# EAGLE design MP3_Testboard (EAGLE 9.2.0)
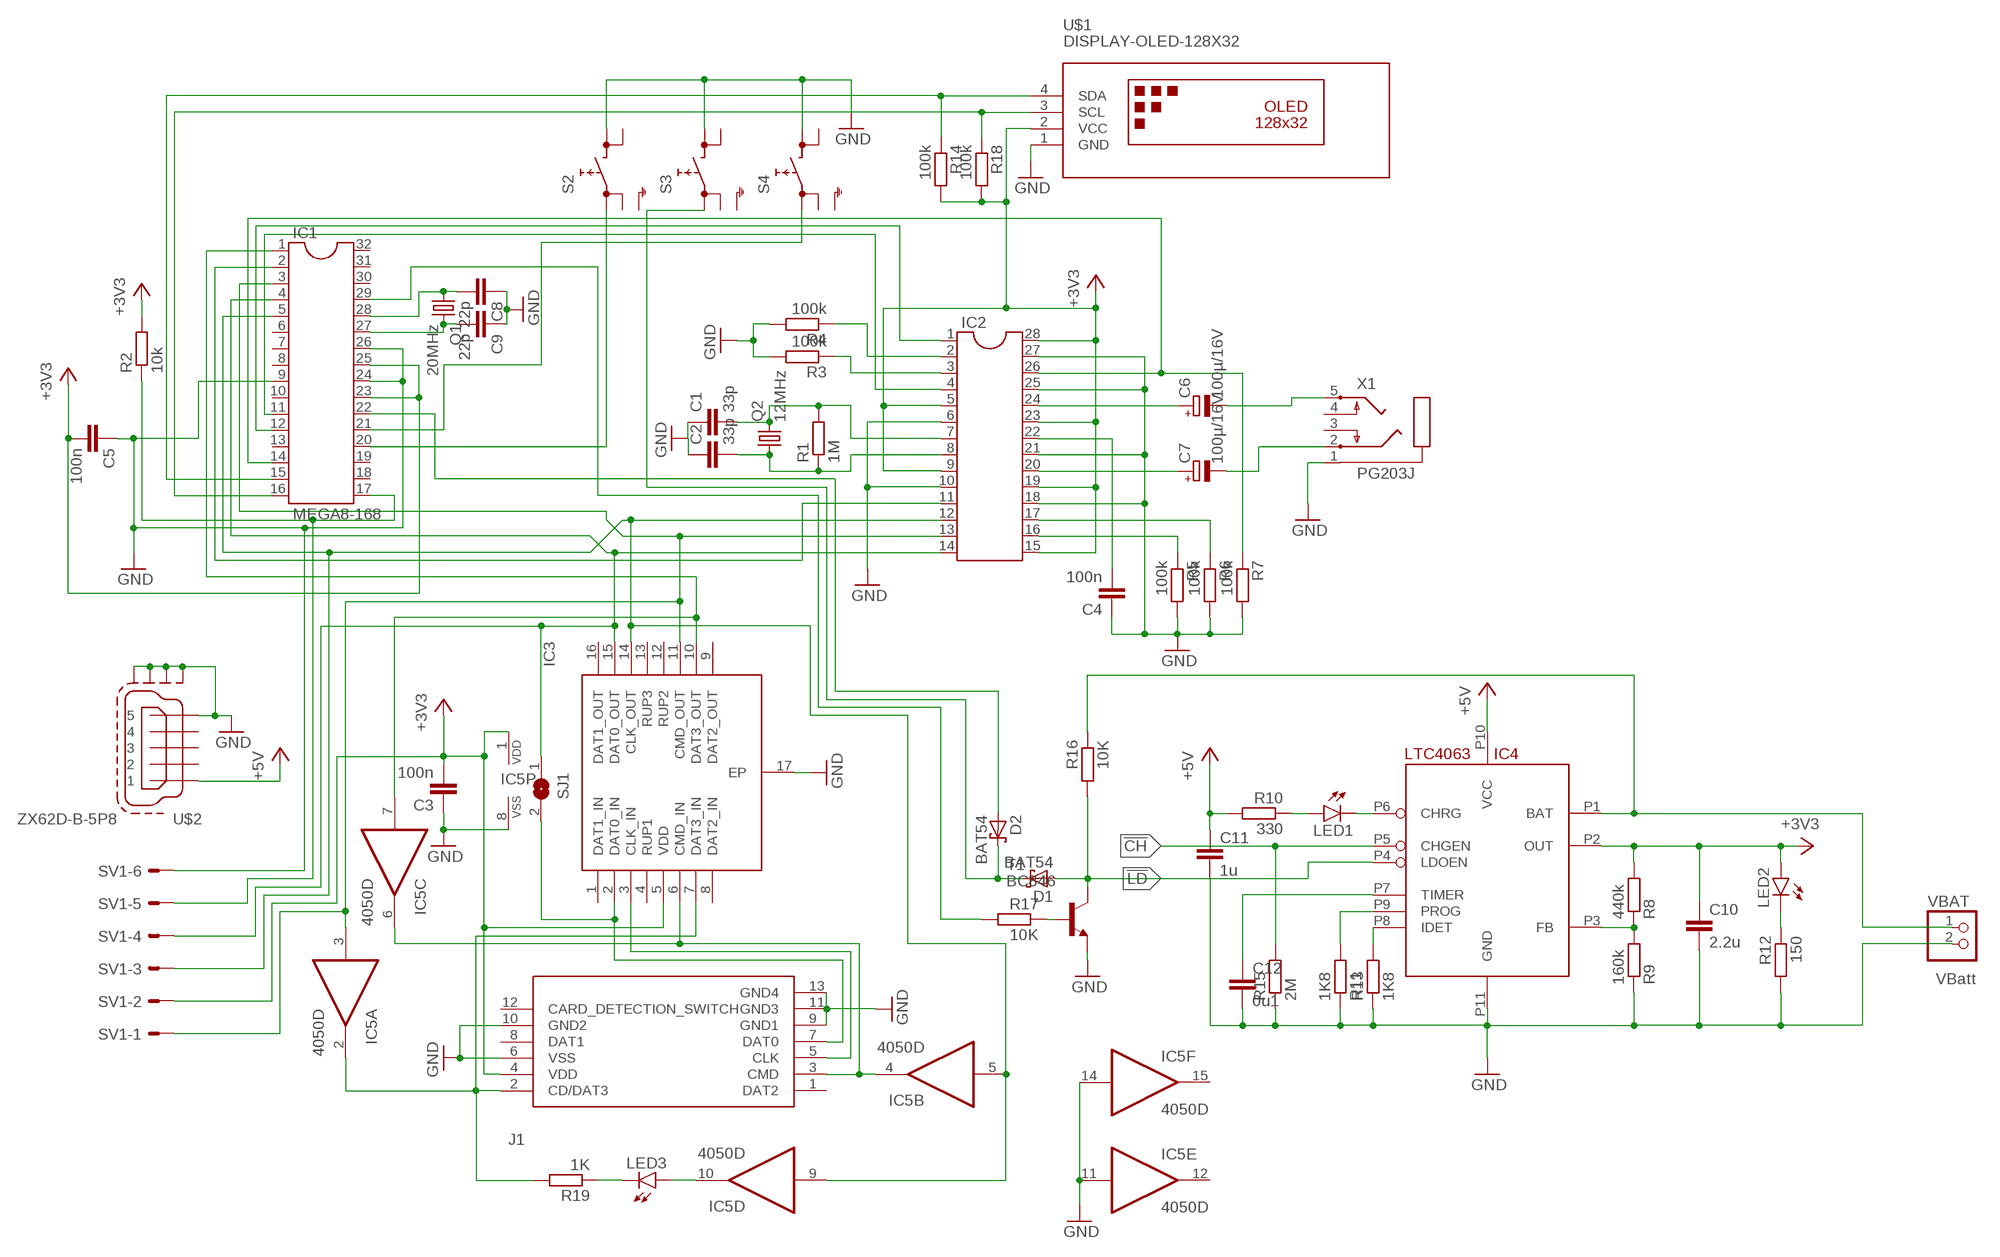
[diagram p0: schematic, sheet 1]

## Parts
C1  33p  C-EUC1206K  [C1206K]
C2  33p  C-EUC1206K  [C1206K]
C3  100n  C-EUC1206K  [C1206K]
C4  100n  C-EUC1206K  [C1206K]
C5  100n  C-EUC1206K  [C1206K]
C6  100µ/16V  CPOL-EUUD-6,3X7,7  [UD-6,3X7,7_NICHICON]
C7  100µ/16V  CPOL-EUUD-6,3X7,7  [UD-6,3X7,7_NICHICON]
C8  22p  C-EUC1206K  [C1206K]
C9  22p  C-EUC1206K  [C1206K]
C10  2.2u  C-EUC0805K  [C0805K]
C11  1u  C-EUC0805K  [C0805K]
C12  0u1  C-EUC0805K  [C0805K]
D1  BAT54  [SOT23]
D2  BAT54  [SOT23]
IC1  MEGA8-168  DIL32  [DIL32]
IC2  DIL28-3  [DIL28-3]
IC3  ECLAMP2410P.TCT  [SON50P160X400X65-17N]
IC4  LTC4063  [LTC4063]
IC5  4050D  [SO16]
J1  DM3CS-SF  [DM3CS-SF]
LED1  LG_T679-E1F1-1  [PLCC2]
LED2  LG_T679-E1F1-1  [PLCC2]
LED3  LG_T679-E1F1-1  [PLCC2]
Q1  20MHz  CRYSTALHC49UP  [HC49UP]
Q2  12MHz  CRYSTALHC49UP  [HC49UP]
R1  1M  R-EU_R0805  [R0805]
R2  10k  R-EU_0207/10  [0207/10]
R3  100k  R-EU_R1206  [R1206]
R4  100k  R-EU_R1206  [R1206]
R5  100k  R-EU_R0805  [R0805]
R6  100k  R-EU_R0805  [R0805]
R7  100k  R-EU_R1206  [R1206]
R8  440k  R-EU_R0805  [R0805]
R9  160k  R-EU_R0805  [R0805]
R10  330  R-EU_R0805  [R0805]
R11  1K8  R-EU_R0805  [R0805]
R12  150  R-EU_R0805  [R0805]
R13  1K8  R-EU_R1206  [R1206]
R14  100k  R-EU_R1206  [R1206]
R15  2M  R-EU_R0805  [R0805]
R16  10K  R-EU_0207/10  [0207/10]
R17  10K  R-EU_R0805  [R0805]
R18  100k  R-EU_R1206  [R1206]
R19  1K  R-EU_R1206  [R1206]
S2  SKHMPSE010  [SKHMPXE010]
S3  SKHMPSE010  [SKHMPXE010]
S4  SKHMPSE010  [SKHMPXE010]
SJ1  SJ  [SJ]
SV1  ML6E  [ML6]
T1  BC846  [SOT23]
U$1  DISPLAY-OLED-128X32  [DISPLAY-OLED-128X32]
U$2  ZX62D-B-5P8  [ZX62D-B-5P8]
VBAT  PINHD-1X2  [1X02]
X1  PG203J  [PG203J]

## Nets
!CH: IC4.P5(CHGEN) R15.2
!LD: D1.1(A) IC4.P4(LDOEN) R16.2 T1.3(C)
+3V3: C3.2 C5.2 C10.1 IC1.23 IC1.25 IC2.5 IC2.9 IC2.15 IC2.19 IC2.23 IC2.28 IC3.5(VDD) IC4.P2(OUT) IC5.1(P:VDD) J1.4(VDD) LED2.A R2.2 R8.2 R14.2 R18.2 SV1.2 U$1.2(VCC)
+5V: C11.1 IC4.P10(VCC) R10.2 U$2.P$1
GND: C1.1 C2.1 C3.1 C4.1 C5.1 C8.1 C9.1 C10.2 C11.2 C12.2 IC1.9 IC1.24 IC1.26 IC2.6 IC2.10 IC2.18 IC2.21 IC2.25 IC2.27 IC3.17(EP) IC4.P11(GND) IC5.8(P:VSS) IC5.11(E:I) IC5.14(F:I) J1.6(VSS) J1.9(GND1) J1.10(GND2) J1.11(GND3) J1.13(GND4) R3.2 R4.2 R5.2 R6.2 R7.2 R9.1 R11.1 R12.2 R13.1 R15.1 S2.3(2.1) S3.3(2.1) S4.3(2.1) SV1.6 T1.2(E) U$1.1(GND) U$2.P$5 U$2.SH1 U$2.SH2 U$2.SH3 U$2.SH4 VBAT.2 X1.1
N$2: IC1.4 IC2.14 IC3.15(DAT0_OUT) SJ1.1 SV1.4
N$3: IC1.5 IC2.12 IC3.14(CLK_OUT) IC5.5(B:I) IC5.9(D:I) SV1.3
N$5: IC1.2 IC2.11
N$6: C2.2 IC2.8 Q2.1 R1.1
N$7: IC1.11 IC2.4
N$8: C4.2 IC2.22
N$9: IC2.3 R3.1
N$10: C1.2 IC2.7 Q2.2 R1.2
N$11: IC2.2 R4.1
N$12: IC1.20 S2.1(1.1)
N$13: IC2.17 R6.1
N$14: IC2.16 R5.1
N$15: IC1.12 IC2.1
N$16: D2.1(A) IC1.22
N$17: IC1.14 IC2.26 R7.1
N$18: IC5.10(D:O) LED3.A
N$19: C7.+ IC2.20
N$20: C6.+ IC2.24
N$21: IC1.21 S4.1(1.1)
N$22: C6.- X1.5
N$23: C7.- X1.2
N$24: C8.2 IC1.28 Q1.1
N$25: C9.2 IC1.27 Q1.2
N$26: LED3.C R19.1
N$27: IC1.17 R2.1 SV1.5
N$28: IC4.P3(FB) R8.1 R9.2
N$29: IC3.7(DAT3_IN) IC5.2(A:O) J1.2(CD/DAT3) R19.2
N$30: IC3.2(DAT0_IN) J1.7(DAT0) SJ1.2
N$31: IC3.3(CLK_IN) J1.5(CLK)
N$32: IC3.6(CMD_IN) IC5.4(B:O) IC5.6(C:O) J1.3(CMD)
N$33: IC4.P1(BAT) R16.1 VBAT.1
N$34: LED1.A R10.1
N$35: IC4.P9(PROG) R11.2
N$36: IC4.P6(CHRG) LED1.C
N$37: LED2.C R12.1
N$38: IC4.P8(IDET) R13.2
N$39: C12.1 IC4.P7(TIMER)
N$40: IC1.15 R14.1 U$1.4(SDA)
N$41: IC1.16 R18.1 U$1.3(SCL)
N$42: IC1.3 IC2.13 IC3.11(CMD_OUT) IC5.3(A:I) SV1.1
N$43: IC1.1 IC3.10(DAT3_OUT) IC5.7(C:I)
N$47: R17.1 T1.1(B)
N$49: IC1.29 R17.2
N$51: D1.3(C) D2.3(C) S3.1(1.1)
Unconnected: IC1.6 IC1.7 IC1.8 IC1.10 IC1.13 IC1.18 IC1.19 IC1.30 IC1.31 IC1.32 IC3.1(DAT1_IN) IC3.4(RUP1) IC3.8(DAT2_IN) IC3.9(DAT2_OUT) IC3.12(RUP2) IC3.13(RUP3) IC3.16(DAT1_OUT) IC5.12(E:O) IC5.15(F:O) J1.1(DAT2) J1.8(DAT1) J1.12(CARD_DETECTION_SWITCH) S2.2(1.2) S2.4(2.2) S2.5(SH) S3.2(1.2) S3.4(2.2) S3.5(SH) S4.2(1.2) S4.4(2.2) S4.5(SH) U$2.P$2 U$2.P$3 U$2.P$4 X1.3 X1.4

## Notes on the sheet
- VBatt

## Library data of the parts
C1-C5 C10-C12 = rcl:C-EU: CAPACITOR, European symbol
C6 C7 = rcl:CPOL-EU: POLARIZED CAPACITOR, European symbol
C8 C9 = rcl:C-EU: CAPACITOR, European symbol; SPICEPREFIX: C
D1 D2 = diode:BAT54: Schottky Diodes Source: Fairchild .. BAT54.pdf
IC1 = ic-package:DIL32: Dual In Line
IC2 = ic-package:DIL28: Dual In Line
IC3 = SamacSys_Parts:ECLAMP2410P.TCT: EClamp ESD-EMI Protect T-Flash/MicroSD Semtech ECLAMP2410P.TCT, Hex Bi-Directional EMI Filter & ESD Protector, 16-Pin SLP EP Source: Datasheet <http://www.semtech.com/images/datasheet/eclamp2410p.pdf>; ARROW_PART_NUMBER: ECLAMP2410P.TCT; ARROW_PRICE/STOCK: https://www.arrow.com/en/products/eclamp2410p.tct/semtech; DESCRIPTION: EClamp ESD-EMI Protect T-Flash/MicroSD Semtech ECLAMP2410P.TCT, Hex Bi-Directional EMI Filter & ESD Protector, 16-Pin SLP EP; HEIGHT: 0.65mm; MANUFACTURER_NAME: SEMTECH; MANUFACTURER_PART_NUMBER: ECLAMP2410P.TCT; RS_PART_NUMBER: 6910638; RS_PRICE/STOCK: http://uk.rs-online.com/web/p/products/6910638
IC4 = LinearTechnology:LTC4063: LTC4063 - Standalone Linear Li-Ion Charger with Micropower Low Dropout Linear Regulator The LTC®4063 is a standalone linear charger for single cell lithium-ion batteries with an adjustable low dropout linear regulator (LDO). The adjustable LDO regulates an output voltage between 1.2V to 4.2V at up to 100mA load cur- rent. When the input supply (wall adapter or USB supply) is removed, the LDO regulates the output voltage without interruption. The battery charger and LDO regulator can be enabled individually. No external sense resistor or external blocking diode is required for charging due to the internal MOSFET archi- tecture. For more details have a look at the data sheet <http://cds.linear.com/docs/en/datasheet/4063fc.pdf>. Copyright (c) 2013, Michael Hohl <http://www.michaelhohl.net>
IC5 = 40xx:4050: Hex non-inverting BUFFER
J1 = SamacSys_Parts:DM3CS-SF: MicroSD card connector, push-pull type MicroSD card connector, push-pull type Source: Datasheet <http://docs-europe.electrocomponents.com/webdocs/118f/0900766b8118f8bb.pdf>; ARROW_PART_NUMBER: DM3CS-SF; ARROW_PRICE/STOCK: https://www.arrow.com/en/products/dm3cs-sf/hirose-electric; DESCRIPTION: MicroSD card connector, push-pull type MicroSD card connector, push-pull type; HEIGHT: mm; MANUFACTURER_NAME: Hirose; MANUFACTURER_PART_NUMBER: DM3CS-SF; RS_PART_NUMBER: 1664833; RS_PRICE/STOCK: http://uk.rs-online.com/web/p/products/1664833
LED1-LED3 = led:*_T679-?-1: LC TOPLED® Low Current LED Source: http://catalog.osram-os.com .. LG_LS_LY_T679_OBS.pdf; COLOR: green
Q1 = crystal:CRYSTAL: CRYSTAL; OC_FARNELL: unknown; OC_NEWARK: unknown
Q2 = crystal:CRYSTAL: CRYSTAL
R1-R10 R12-R19 = rcl:R-EU_: RESISTOR, European symbol; SPICEPREFIX: R
R11 = rcl:R-EU_: RESISTOR, European symbol
S2-S4 = switch:SKHMP*E010: 6.2 X 6.5mm TACT Switch (SMD) Source: http://www3.alps.co.jp/WebObjects/catalog.woa/PDF/E/Switch/Tact/SKHM/SKHM.PDF
SJ1 = jumper:SJ: SMD solder JUMPER
SV1 = con-ml:ML6E: HARTING; OC_FARNELL: unknown; OC_NEWARK: unknown
T1 = transistor-neu-to92:BC846: NPN TRANSISTOR
U$1 = diy-modules:DISPLAY-OLED-128X32: 128x32 Dot Matrix OLED Module with I2C interface based on SSD1306 chip More details available here: http://www.tinyosshop.com/index.php?route=product/product&product_id=953 Schematic available here: http://www.tinyosshop.com/datasheet/OLED%2012832.pdf SSD1306 datasheet: https://cdn-shop.adafruit.com/datasheets/SSD1306.pdf Click here to find device on ebay.com <http://www.ebay.com/sch/oled+display+128x32+i2c>
U$2 = j_usb_hirose_zx62d-b-5p8:ZX62D-B-5P8: Hirose ZX62D-B-5P8 Micro-B USB connector, standard mount location, with through-hold shell tabs and SMD pins.
VBAT = pinhead:PINHD-1X2: PIN HEADER
X1 = con-hirschmann:PG203J: MIC/HEADPHONE JACK KS-S stereo microphone/headphone jack PG203JN (Schukat); OC_FARNELL: unknown; OC_NEWARK: unknown

## Board
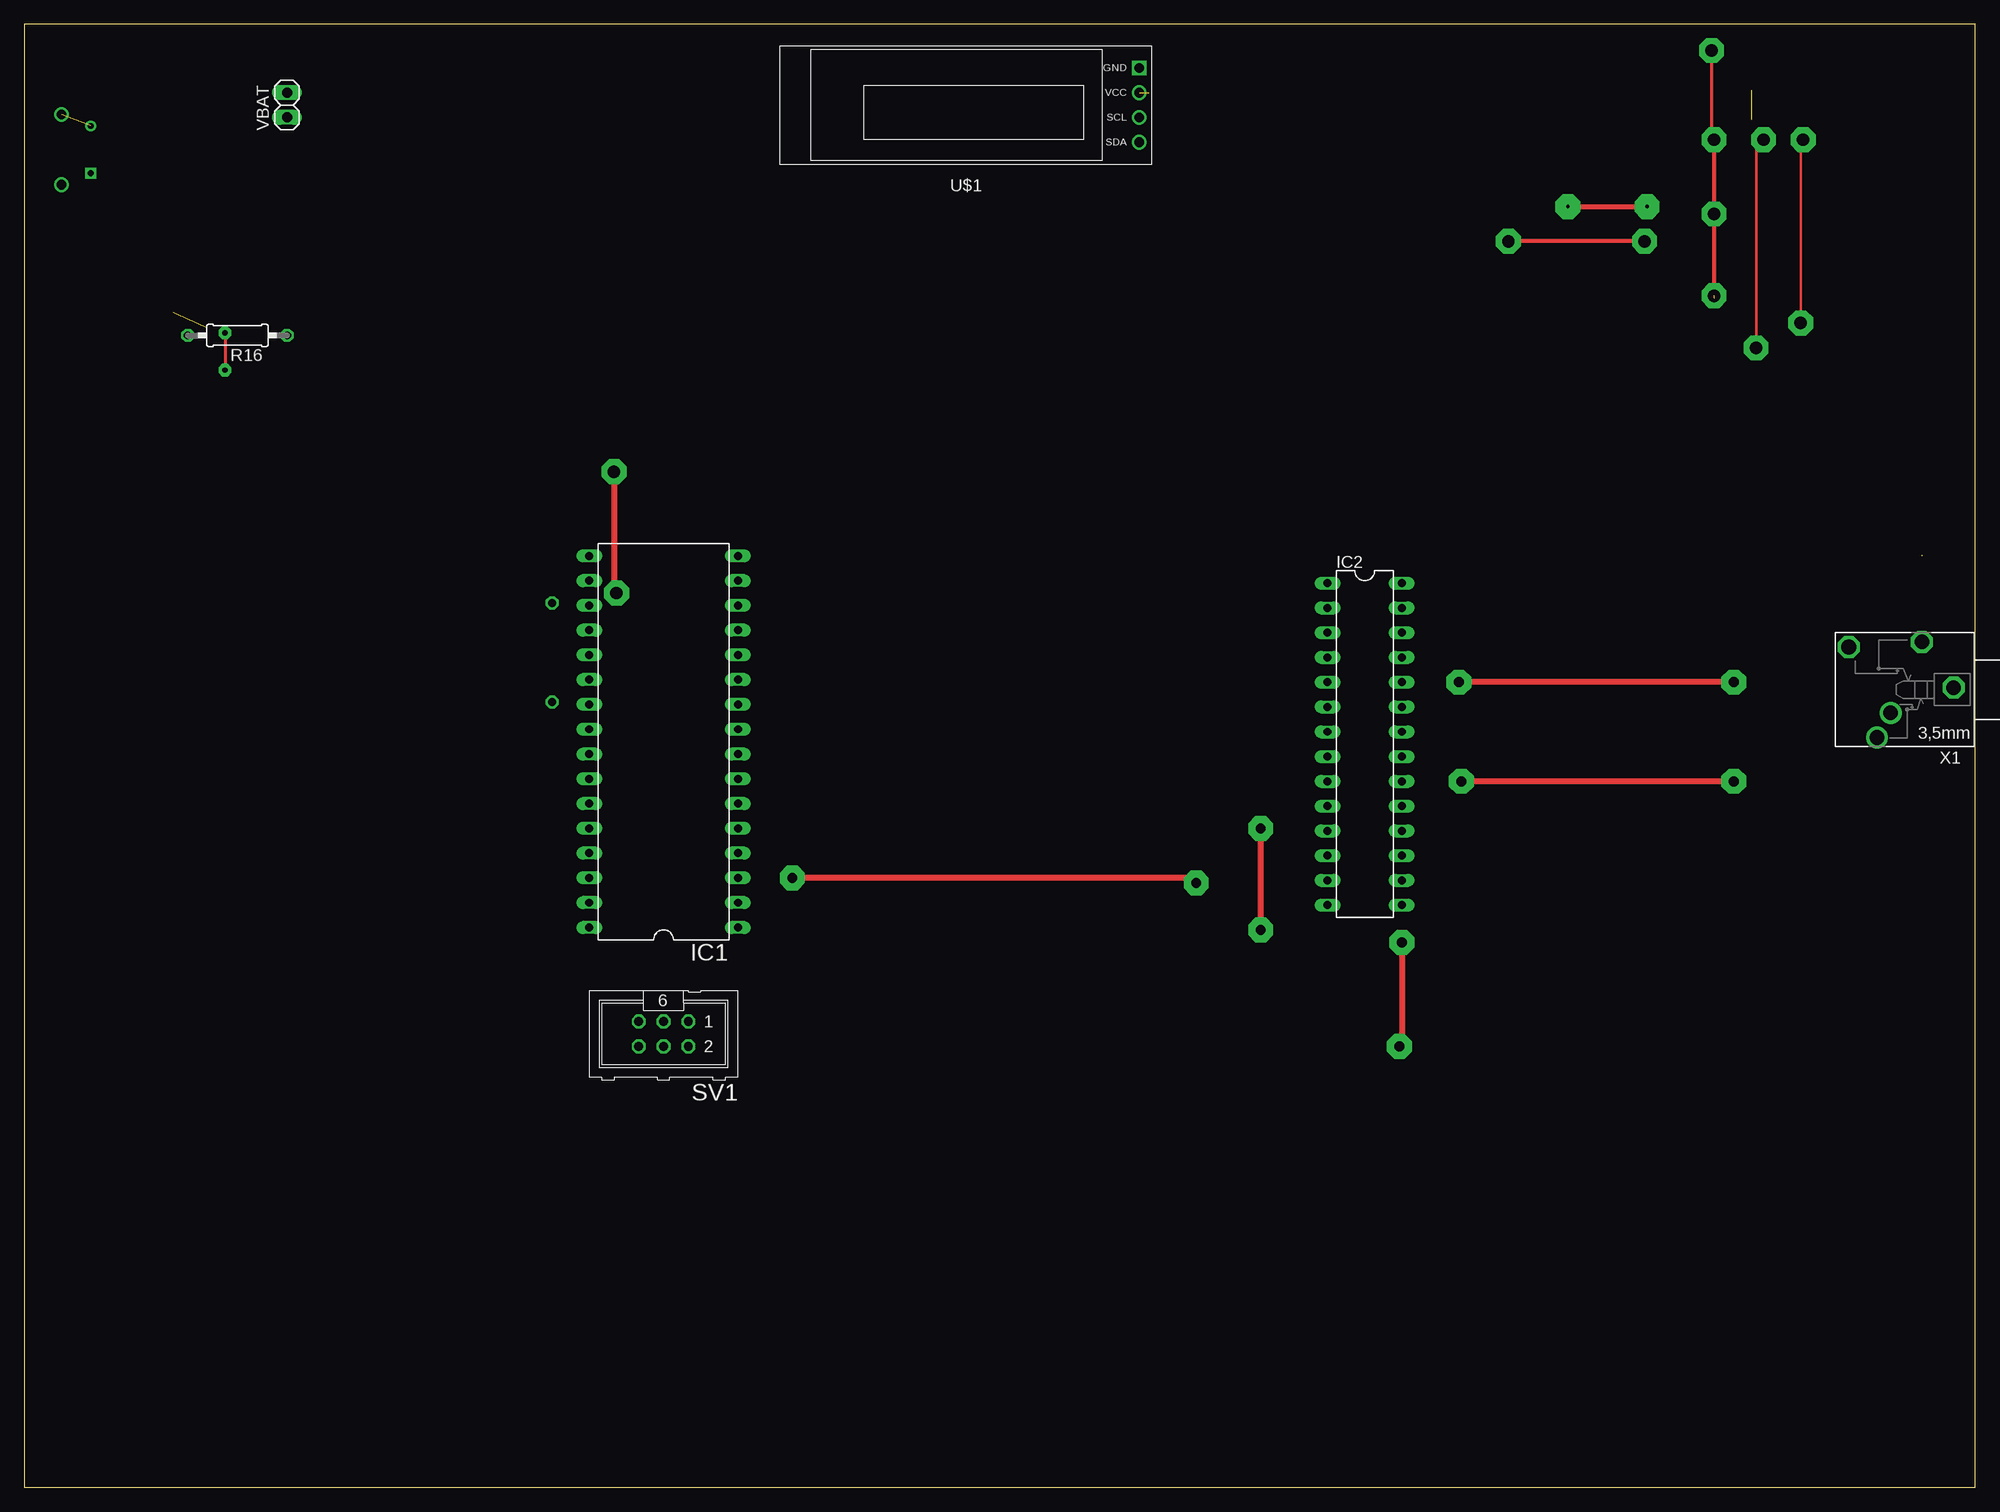
[diagram p1: board, top side]
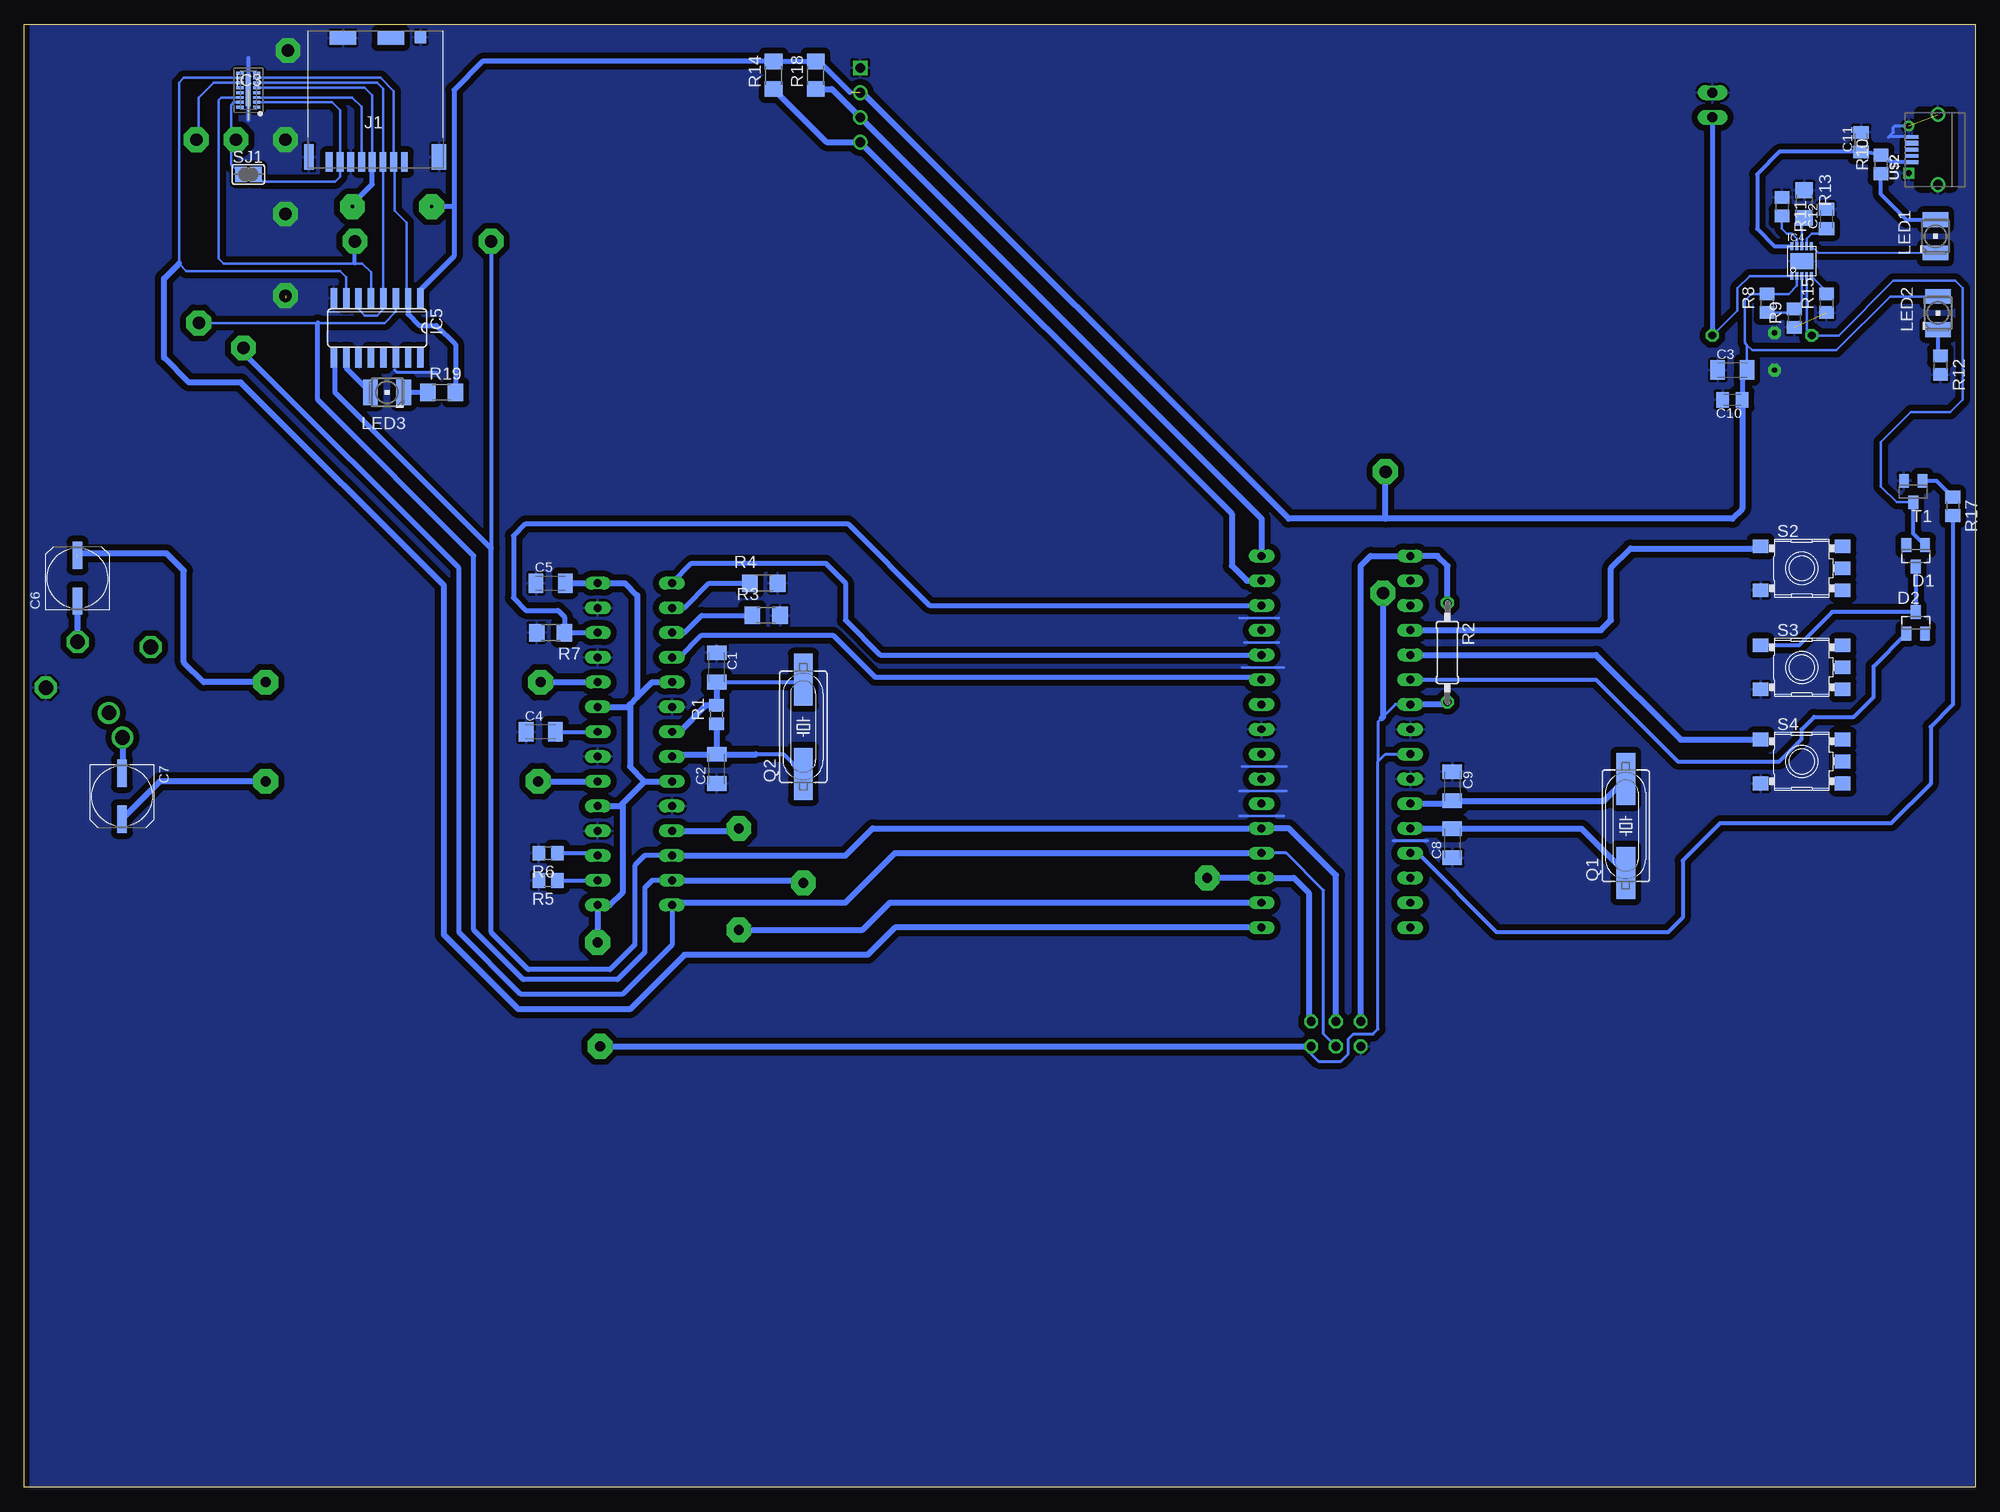
[diagram p2: board, bottom side, seen from below]

Size 200 x 150 mm. Coordinates in mm from the lower left corner, seen from the top.
Outline: 0,0 200,0 200,150 0,150 0,0
Copper layers (1*16): Top 0.035mm / dielectric 1.5mm / Bottom 0.035mm
Design rules "default *": minimum track width 6mil, minimum drill 0.35mm, track to track 6mil, track to pad 6mil, pad to pad 6mil, via to via 6mil, smd to smd 6mil, copper to edge 0mil, drill to drill 6mil, minimum pad ring 10mil, minimum via ring 8mil, stop-mask expansion 4mil, vias tented up to drill 0mil, thermal gap 10mil

### Footprints (pad centres in the part's own frame; a part is rotated, then mirrored left to right if it is on the bottom)
C1206K = smd 1.5 x 2: 1 -1.5,0; 2 1.5,0
UD-6,3X7,7_NICHICON = smd 2.8 x 1: + 2.35,0; - -2.35,0
C0805K = smd 1.3 x 1.6: 1 -1,0; 2 1,0
SOT23 = smd 1 x 1.4: 1 -0.95,-1.1; 2 0.95,-1.1; 3 0,1.1
DIL32 = drill 0.813 long: 1 -19.05,-7.62; 2 -16.51,-7.62; 3 -13.97,-7.62; 4 -11.43,-7.62; 5 -8.89,-7.62; 6 -6.35,-7.62; 7 -3.81,-7.62; 8 -1.27,-7.62; 9 1.27,-7.62; 10 3.81,-7.62; 11 6.35,-7.62; 12 8.89,-7.62; 13 11.43,-7.62; 14 13.97,-7.62; 15 16.51,-7.62; 16 19.05,-7.62; 17 19.05,7.62; 18 16.51,7.62; 19 13.97,7.62; 20 11.43,7.62; 21 8.89,7.62; 22 6.35,7.62; 23 3.81,7.62; 24 1.27,7.62; 25 -1.27,7.62; 26 -3.81,7.62; 27 -6.35,7.62; 28 -8.89,7.62; 29 -11.43,7.62; 30 -13.97,7.62; 31 -16.51,7.62; 32 -19.05,7.62
DIL28-3 = drill 0.813 long: 1 -16.51,-3.81; 2 -13.97,-3.81; 3 -11.43,-3.81; 4 -8.89,-3.81; 5 -6.35,-3.81; 6 -3.81,-3.81; 7 -1.27,-3.81; 8 1.27,-3.81; 9 3.81,-3.81; 10 6.35,-3.81; 11 8.89,-3.81; 12 11.43,-3.81; 13 13.97,-3.81; 14 16.51,-3.81; 15 16.51,3.81; 16 13.97,3.81; 17 11.43,3.81; 18 8.89,3.81; 19 6.35,3.81; 20 3.81,3.81; 21 1.27,3.81; 22 -1.27,3.81; 23 -3.81,3.81; 24 -6.35,3.81; 25 -8.89,3.81; 26 -11.43,3.81; 27 -13.97,3.81; 28 -16.51,3.81
SON50P160X400X65-17N = smd 0.75 x 0.3: 1 -0.85,1.75; 2 -0.85,1.25; 3 -0.85,0.75; 4 -0.85,0.25; 5 -0.85,-0.25; 6 -0.85,-0.75; 7 -0.85,-1.25; 8 -0.85,-1.75; 9 0.85,-1.75; 10 0.85,-1.25; 11 0.85,-0.75; 12 0.85,-0.25; 13 0.85,0.25; 14 0.85,0.75; 15 0.85,1.25; 16 0.85,1.75 | smd 0.5 x 3.3: 17 0,0
LTC4063 = smd 0.3 x 0.8: P1 -1,-1.525; P2 -0.5,-1.525; P3 0,-1.525; P4 0.5,-1.525; P5 1,-1.525; P6 1,1.525; P7 0.5,1.525; P8 0,1.525; P9 -0.5,1.525; P10 -1,1.525 | smd 2.38 x 1.65: P11 0,0
SO16 = smd 0.66 x 2.032: 1 -4.445,-3.073; 2 -3.175,-3.073; 3 -1.905,-3.073; 4 -0.635,-3.073; 5 0.635,-3.073; 6 1.905,-3.073; 7 3.175,-3.073; 8 4.445,-3.073; 9 4.445,3.073; 10 3.175,3.073; 11 1.905,3.073; 12 0.635,3.073; 13 -0.635,3.073; 14 -1.905,3.073; 15 -3.175,3.073; 16 -4.445,3.073
DM3CS-SF = smd 0.7 x 2: 1 0,0; 2 -1.1,0; 3 -2.2,0; 4 -3.3,0; 5 -4.4,0; 6 -5.5,0; 7 -6.6,0; 8 -7.7,0 | smd 1 x 2.6: 9 -9.8,0.5 | smd 1.5 x 2.6: 10 3.55,0.5 | smd 1.2 x 1.2: 11 1.65,12.8 | smd 2.7 x 1.4: 12 -1.4,12.7; 13 -6.3,12.7
PLCC2 = smd 2.6 x 1.5: A 0,1.7; C 0,-1.7
HC49UP = smd 5.334 x 1.93: 1 -4.826,0; 2 4.826,0
R0805 = smd 1.3 x 1.5: 1 -0.95,0; 2 0.95,0
0207/10 = drill 0.813 octagon: 1 -5.08,0; 2 5.08,0
R1206 = smd 1.6 x 1.803: 1 -1.422,0; 2 1.422,0
SKHMPXE010 = smd 1.6 x 1.4: 1 -4.2,2.25; 2 4.2,2.25; 3 -4.2,-2.25; 4 4.2,-2.25; 5 4.2,0
SJ = smd 1.168 x 1.6: 1 -0.762,0; 2 0.762,0
ML6 = drill 0.914 octagon: 1 -2.54,-1.27; 2 -2.54,1.27; 3 0,-1.27; 4 0,1.27; 5 2.54,-1.27; 6 2.54,1.27
DISPLAY-OLED-128X32 = drill 1 square: 1 -17.78,-3.81 | drill 1: 2 -17.78,-1.27; 3 -17.78,1.27; 4 -17.78,3.81
ZX62D-B-5P8 = smd 0.4 x 1.35: P$1 -1.3,2.675; P$2 -0.65,2.675; P$3 0,2.675; P$4 0.65,2.675; P$5 1.3,2.675 | drill 0.6 pad 1 square: SH1 -2.425,3 | drill 0.6 pad 1: SH2 2.425,3 | drill 1 pad 1.4: SH3 -3.6,0; SH4 3.6,0
1X02 = drill 1.016 long: 1 -1.27,0; 2 1.27,0
PG203J = drill 1.499 octagon: 1 -5.004,-0.203; 4 5.74,-4.369; 5 -1.753,-4.902 | drill 1.499: 2 2.845,4.902; 3 1.448,2.388

### Placement (x,y rotation side)
C1  129.03,84.07 270 bottom
C2  129.03,73.66 90 bottom
C3  24.89,114.55 0 bottom
C4  147.07,77.47 0 bottom
C5  146.05,92.71 0 bottom
C6  194.56,93.22 90 bottom
C7  189.99,70.87 270 bottom
C8  53.59,66.04 90 bottom
C9  53.59,71.88 270 bottom
C10  24.89,111.51 180 bottom
C11  11.68,137.92 90 bottom
C12  15.24,130.05 90 bottom
D1  6.1,95.5 180 bottom
D2  6.1,88.65 0 bottom
IC1  65.53,76.45 90 top
IC2  137.41,76.2 270 top
IC3  177.04,143.26 180 bottom
IC4  17.78,125.73 0 bottom
IC5  163.83,118.87 180 bottom
J1  161.04,135.89 0 bottom
LED1  4.06,128.27 0 bottom
LED2  3.81,120.4 0 bottom
LED3  162.81,112.27 90 bottom
Q1  35.81,67.82 90 bottom
Q2  120.14,77.98 90 bottom
R1  129.03,79.25 90 bottom
R2  54.1,85.6 270 bottom
R3  123.95,89.41 0 bottom
R4  124.21,92.71 0 bottom
R5  146.3,62.23 180 bottom
R6  146.3,65.02 180 bottom
R7  146.05,87.63 180 bottom
R8  21.34,121.41 90 bottom
R9  18.54,119.89 90 bottom
R10  9.65,135.64 90 bottom
R11  19.81,131.32 270 bottom
R12  3.56,115.06 270 bottom
R13  17.53,131.57 270 bottom
R14  123.19,144.78 90 bottom
R15  15.24,121.41 90 bottom
R16  21.84,118.11 180 top
R17  2.29,100.58 270 bottom
R18  118.87,144.78 90 bottom
R19  157.23,112.27 0 bottom
S2  17.78,94.23 0 bottom
S3  17.78,84.07 0 bottom
S4  17.78,74.42 0 bottom
SJ1  177.04,134.62 0 bottom
SV1  65.53,46.48 180 top
T1  6.35,102.11 180 bottom
U$1  96.52,141.73 180 top
U$2  3.81,137.16 90 bottom
VBAT  26.92,141.73 90 top
X1  192.79,81.79 180 top

### Tracks (layer width: path | path; a pad name or v marks a point on that pad's centre or on a via)
!CH
  Bottom 0.254: IC4.P5 15.24,122.67 R15.2
!LD
  Bottom 0.254: IC4.P4 17.27,118.62 R16.2 13.97,118.11 8.38,123.7 2.03,123.7 1.27,122.94 1.27,111.51 2.54,110.24 6.6,110.24 9.65,107.19 9.65,102.62 8.04,101.01 T1.3
  Bottom 0.406: D1.1 6.35,97.81 T1.3
+3V3  (via drill 0.35 pad 2.54, 1 pad 2.54, 1.27 pad 2.54)  (1 unrouted)
  Top 0.508: v158.24,131.32 v166.37,131.32 166.62,131.32
  Top 0.61: v141.22,55.88 141.22,45.47 v140.97,45.21 | v60.45,104.14 60.45,92.71 60.71,92.46 v60.71,91.69
  Bottom 0.254: IC4.P2 18.28,123.2 19.12,122.36 R8.2 22.79,122.36 22.86,122.43 23.62,121.67 23.62,117.35 23.39,117.12 | 23.39,117.12 22.86,116.59 14.22,116.59 8.71,122.1 LED2.A | C3.2 23.39,117.12 | J1.4 164.34,142.75 165.1,143.51 IC3.5
  Bottom 0.305: 61.21,74.42 60.45,75.18 IC1.25 | 61.21,74.42 61.21,46.99 61.72,46.48 63.75,46.48 64.26,45.97 64.26,44.45 65.02,43.69 67.31,43.69 68.07,44.45 SV1.2 | IC1.23 58.42,80.26 59.44,80.26 60.83,78.87 61.21,78.49 61.21,74.42
  Bottom 0.508: 115.32,143 118.52,146.2 R18.2 R14.2 153.01,146.2 155.96,143.26 155.96,131.32 | C3.2 23.89,114.05 C10.1 | 155.96,131.32 155.96,126.24 159.38,122.81 IC5.1 | 155.96,131.32 v158.24,131.32 | v166.37,131.32 166.37,131.57 164.34,133.6 J1.4
  Bottom 0.61: IC2.5 135.64,82.55 137.16,81.03 | 137.92,80.26 137.16,81.03 | 137.92,80.26 138.18,80.01 IC2.23 | C5.2 IC2.28 138.43,92.71 137.16,91.44 137.16,81.03 | 136.4,72.39 IC2.9 | 136.4,72.39 137.92,73.91 137.92,80.26 | 138.68,70.1 136.4,72.39 | 138.68,70.1 138.94,69.85 IC2.19 | 138.68,70.1 138.68,60.96 139.95,59.69 IC2.15 v141.22,55.88 141.22,55.63 | R2.2 54.36,80.26 58.42,80.26 | v140.97,45.21 SV1.2 | C10.1 23.89,100.31 24.89,99.31 60.45,99.31 | 60.45,99.31 70.36,99.31 114.05,143 U$1.2 | 60.45,99.31 v60.45,104.14 | v60.71,91.69 60.71,78.99 60.83,78.87
+5V
  Bottom 0.203: 19.3,127.25 IC4.P10
  Bottom 0.406: U$2.P$1 8.61,135.86 9.14,136.4 R10.2 11.63,136.97 C11.1 20.05,136.92 22.35,134.62 22.35,129.03 20.57,127.25 19.3,127.25 19.04,127.25
GND  (via drill 0.55 pad 1.3, 1.27 pad 2.54)  (5 unrouted)
  Top 0.305: v172.97,147.32 172.97,138.18 173.23,137.92 | v20.57,118.36 v20.57,114.55
  Top 0.406: v173.23,138.18 173.23,137.92 v173.23,130.56 173.23,121.92
  Bottom 0.254: 70.87,84.07 75.18,84.07 | 71.37,89.15 75.44,89.15 | 71.37,86.61 74.93,86.61 | 70.61,73.91 75.18,73.91 | 70.61,71.37 75.44,71.37 | 70.87,68.83 75.44,68.83
  Bottom 0.305: 157.73,114.3 161.8,114.3 162.05,114.55 | U$2.P$5 8.86,138.46 | 8.86,138.46 8.89,138.43 | 8.86,138.46 8.38,138.94 8.38,139.45 8.24,139.59 U$2.SH2 | 56.13,66.29 59.69,66.29
  Bottom 0.406: 177.04,146.56 177.04,140.21
  other vias: 173.23,122.17 3.81,133.6 3.81,140.72
  pour Bottom (isolate 0.61): 0,0 199.39,0 199.39,149.86 0,149.86
N$2  (via drill 1.27 pad 2.54)
  Top 0.254: v178.31,138.18 177.55,137.41 v177.55,116.84
  Bottom 0.254: SJ1.1 178.82,135.64 178.82,138.43 | 178.82,138.43 178.82,141.73 178.54,142.01 IC3.15 | 178.82,138.43 178.56,138.18 v178.31,138.18
  Bottom 0.305: IC1.4 70.61,65.02 66.8,61.21 66.8,46.48 SV1.4
  Bottom 0.508: IC2.14 133.6,55.63 138.68,50.55 149.1,50.55 155.45,56.9 155.45,94.23 177.55,116.33 v177.55,116.84
  Bottom 0.61: IC1.4 110.74,65.02 115.82,59.94 133.35,59.94 IC2.14
N$3  (via drill 1.27 pad 2.54)
  Top 0.406: v166.12,127.76 v152.15,127.76
  Bottom 0.254: IC5.5 164.47,124.59 165.35,125.48 166.12,125.48 179.58,125.48 180.09,125.98 180.09,142.24 179.82,142.51 IC3.14
  Bottom 0.406: v152.15,127.76 152.15,96.27 | 166.12,125.48 v166.12,127.76
  Bottom 0.508: IC2.12 136.4,64.77 137.41,63.75 137.41,55.63 139.95,53.09 148.34,53.09 152.15,56.9 152.15,96.27 168.15,112.27 168.15,115.67 IC5.9
  Bottom 0.61: SV1.3 65.53,62.74 70.36,67.56 IC1.5 113.03,67.56 115.82,64.77 IC2.12
N$5  (via drill 1 pad 2.54)
  Top 0.61: v126.75,67.56 v126.75,57.15
  Bottom 0.61: v126.75,67.56 127,67.31 IC2.11 | v126.75,57.15 114.05,57.15 111.25,59.94 IC1.2
N$6
  Bottom 0.406: 124.99,75.16 124.97,75.18 122.17,75.18 Q2.1 | IC2.8 133.07,74.93 132.84,75.16
  Bottom 0.61: C2.2 124.99,75.16 | C2.2 133.37,75.16 IC2.8 | R1.1 C2.2
N$7
  Bottom 0.508: IC2.4 132.84,85.09 130.56,87.38 117.09,87.38 112.78,83.06 73.41,83.06 IC1.11
N$8
  Bottom 0.406: C4.2 IC2.22
N$9
  Bottom 0.508: IC2.3 132.33,87.63 130.56,89.41 R3.1
N$10
  Bottom 0.406: Q2.2 120.37,82.57 C1.2 129.29,82.57
  Bottom 0.61: C1.2 R1.2 130.11,80.2 132.84,77.47 IC2.7
N$11
  Bottom 0.508: IC2.2 132.33,90.17 129.79,92.71 R4.1
N$12
  Bottom 0.61: IC1.20 38.35,87.88 37.34,88.9 37.34,94.23 35.31,96.27 22.2,96.27 S2.1
N$13
  Bottom 0.406: R6.1 141.48,65.02 IC2.17
N$14
  Bottom 0.406: R5.1 IC2.16
N$15
  Bottom 0.508: IC2.1 131.57,94.74 117.86,94.74 115.82,92.71 115.82,88.9 112.27,85.34 IC1.12
N$16
  Bottom 0.406: IC1.22 38.86,82.8 30.48,74.42 20.07,74.42 17.78,76.71 17.78,77.72 16.51,78.99 12.45,78.99 10.41,81.03 10.41,84.18 D2.1
N$17
  Bottom 0.508: IC2.26 R7.1 144.63,89.26 145.29,89.92 148.59,89.92 149.86,91.19 149.86,97.54 148.59,98.81 115.57,98.81 107.19,90.42 IC1.14
N$18
  Bottom 0.508: LED3.A 167,114.76 IC5.10
N$19  (via drill 1.02 pad 2.54)
  Top 0.61: v175.26,72.39 v147.32,72.39
  Bottom 0.61: C7.+ 186.12,72.39 v175.26,72.39 | v147.32,72.39 IC2.20
N$20  (via drill 1.02 pad 2.54)  (1 unrouted)
  Top 0.61: v175.26,82.55 v147.07,82.55
  Bottom 0.61: 194.56,95.5 194.31,95.76 185.42,95.76 183.64,93.98 183.64,84.58 181.61,82.55 v175.26,82.55 | v147.07,82.55 IC2.24
N$21
  Bottom 0.61: IC1.21 38.86,85.34 30.19,76.67 S4.1
N$22
  Bottom 0.406: 194.56,86.72 X1.5
  Bottom 0.61: C6.- 194.56,86.72
N$23
  Bottom 0.61: X1.2 189.94,73.27 C7.-
N$24
  Bottom 0.61: IC1.28 57.89,67.54 C8.2 40.36,67.54 Q1.1
N$25
  Bottom 0.61: IC1.27 53.87,70.1 C9.2 38.08,70.38 Q1.2
N$26
  Bottom 0.508: R19.1 LED3.C
N$27
  Bottom 0.61: SV1.5 62.99,94.49 61.98,95.5 IC1.17 55.12,95.5 54.1,94.49 R2.1
N$28
  Bottom 0.254: IC4.P3 17.78,121.6 R9.2 18.92,120.46 R8.1
N$29
  Bottom 0.254: J1.2 162.05,135.97 | IC5.2 160.82,122.11 160.82,129.69 162.05,130.91 162.05,135.72 162.14,135.64 J1.2 | J1.2 162.14,143.17 163.47,144.51 IC3.7 176.17,144.53
  Bottom 0.508: IC5.2 160.66,120.27 159.51,119.13 157.73,119.13 155.8,117.2 R19.2
N$30
  Bottom 0.254: IC3.2 168.42,142.01 167.64,141.22 J1.7 167.64,134.37 168.15,133.86 175.51,133.86 SJ1.2
N$31
  Bottom 0.254: 165.35,135.97 J1.5 165.44,141.56 166.38,142.51 IC3.3
N$32
  Bottom 0.254: 163.32,135.98 J1.3 | J1.3 163.19,135.85 IC5.4 163.19,120.78 163.83,120.14 165.1,120.14 165.74,120.78 IC5.6 | J1.3 163.24,143.42 163.83,144.02 176.18,144.02 IC3.6
N$33
  Bottom 0.254: R16.1 24.38,120.65 24.38,122.94 23.11,124.2 IC4.P1
  Bottom 0.508: VBAT.1 R16.1
N$34
  Bottom 0.406: LED1.A 7.03,129.97 9.65,132.59 R10.1
N$35
  Bottom 0.254: IC4.P9 18.28,128.01 18.8,128.52 19.3,128.52 19.81,129.03 R11.2
N$36
  Bottom 0.203: IC4.P6 16.09,126.57 LED1.C
N$37
  Bottom 0.406: LED2.C 3.81,116.27 R12.1
N$38
  Bottom 0.254: IC4.P8 17.78,129.9 R13.2
N$39
  Bottom 0.254: IC4.P7 17.28,128.01 16.76,128.52 15.76,128.52 C12.1
N$40
  Bottom 0.61: R14.1 117.75,137.92 U$1.4 76.2,99.82 76.2,94.49 74.68,92.96 IC1.15
N$41
  Bottom 0.61: IC1.16 73.15,99.31 U$1.3 117.2,143.36 R18.1
N$42  (via drill 1 pad 2.54, 1.27 pad 2.54)
  Top 0.254: v182.37,138.18 182.12,137.92 182.12,120.14 181.36,119.38 v182.12,119.38
  Top 0.61: v78.74,62.48 119.38,62.48 119.89,61.98 v120.14,61.98
  Bottom 0.254: IC3.11 180.61,144.01 182.12,142.49 182.12,138.43 v182.37,138.18 | v182.12,119.38 169.93,119.38 163.07,119.38 161.93,120.52 IC5.3
  Bottom 0.508: IC2.13 135.64,62.23 136.4,61.47 136.4,54.86 139.19,52.07 148.84,52.07 153.92,57.15 153.92,95.5 169.93,111.51 169.93,119.38
  Bottom 0.61: SV1.1 68.33,48.01 68.33,60.96 69.85,62.48 IC1.3 v78.74,62.48 | v120.14,61.98 120.4,62.23 IC2.13
N$43
  Bottom 0.254: IC5.7 167,124.08 167.64,124.71 183.39,124.71 184.15,125.48 184.15,144.02 183.66,144.51 IC3.10
  Bottom 0.61: IC1.1 110.74,57.4 113.54,54.61 132.33,54.61 137.92,49.02 149.35,49.02 156.97,56.64 156.97,92.46 177.8,113.28 183.13,113.28 185.67,115.82 185.67,123.95 184.15,125.48
N$47
  Bottom 0.406: 1.8,102.02 R17.1 3.96,103.21 T1.1
N$49
  Bottom 0.406: R17.2 2.29,80.26 4.57,77.98 4.57,72.14 8.64,68.07 26.16,68.07 29.97,64.26 29.97,58.42 31.5,56.9 49.02,56.9 57.15,65.02 IC1.29
N$51
  Bottom 0.406: D1.3 D2.3 14.65,89.75 18.07,86.32 S3.1